# EAGLE schematic deska (EAGLE 7.7.0)
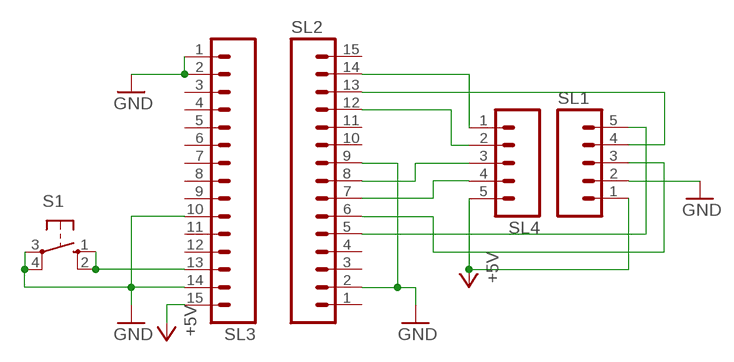
[diagram p0: schematic, sheet 1]

## Parts
S1  10-XX  [B3F-10XX]
SL1  MA05  [05PA]
SL2  MA15  [15PA]
SL3  MA15  [15PA]
SL4  MA05  [05PA]

## Nets
+5V: SL1.1 SL3.15 SL4.5
GND: S1.3(P) S1.4(P1) SL1.2 SL2.2 SL2.9 SL3.1 SL3.2 SL3.10 SL3.14
N$1: SL2.14 SL4.1
N$2: SL1.5 SL2.5
N$3: SL2.12 SL4.2
N$4: SL1.4 SL2.13
N$5: SL2.8 SL4.3
N$6: SL1.3 SL2.6
N$7: SL2.7 SL4.4
N$10: S1.1(S) S1.2(S1) SL3.13
Unconnected: SL2.1 SL2.3 SL2.4 SL2.10 SL2.11 SL2.15 SL3.3 SL3.4 SL3.5 SL3.6 SL3.7 SL3.8 SL3.9 SL3.11 SL3.12

## Library data of the parts
S1 = switch-omron:10-XX: OMRON SWITCH; MPN: B3F-1000; OC_FARNELL: 176432; OC_NEWARK: 36M3542
SL1 SL4 = con-amp-quick:MA05: AMP QUICK CONNECTOR; OC_FARNELL: unknown; OC_NEWARK: unknown
SL2 SL3 = con-amp-quick:MA15: AMP QUICK CONNECTOR; OC_FARNELL: unknown; OC_NEWARK: unknown